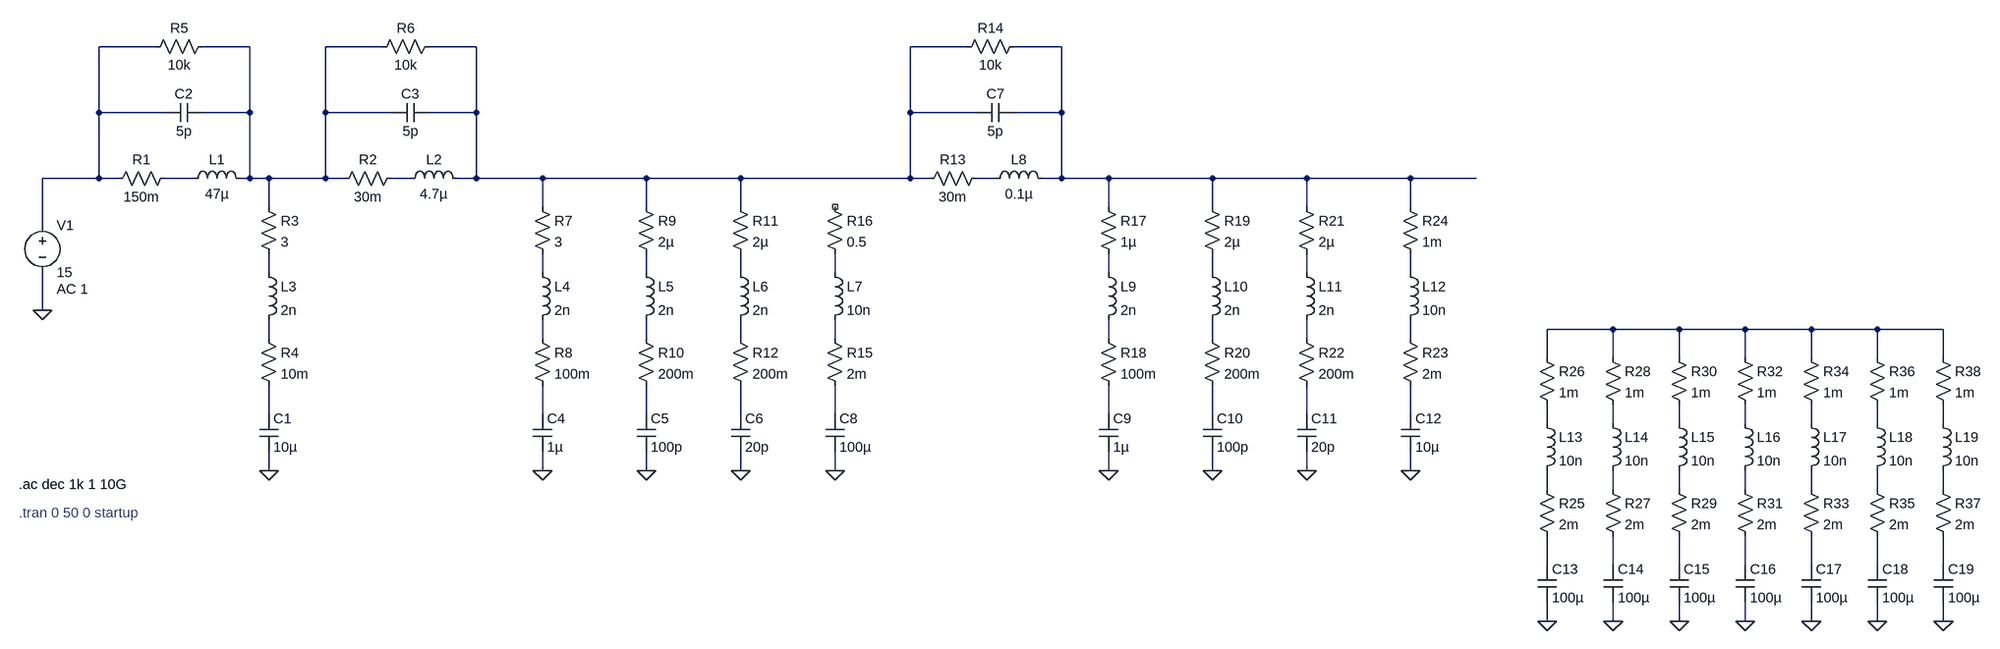
[diagram p0: schematic EMI_Filter.asc]
EMI_Filter.asc, the LTspice schematic file:
Version 4
SHEET 1 4652 1140
WIRE 320 -176 224 -176
WIRE 480 -176 400 -176
WIRE 704 -176 608 -176
WIRE 864 -176 784 -176
WIRE 1696 -176 1600 -176
WIRE 1856 -176 1776 -176
WIRE 224 -64 224 -176
WIRE 336 -64 224 -64
WIRE 480 -64 480 -176
WIRE 480 -64 400 -64
WIRE 608 -64 608 -176
WIRE 720 -64 608 -64
WIRE 864 -64 864 -176
WIRE 864 -64 784 -64
WIRE 1600 -64 1600 -176
WIRE 1712 -64 1600 -64
WIRE 1856 -64 1856 -176
WIRE 1856 -64 1776 -64
WIRE 224 48 224 -64
WIRE 224 48 128 48
WIRE 256 48 224 48
WIRE 384 48 336 48
WIRE 480 48 480 -64
WIRE 480 48 464 48
WIRE 512 48 480 48
WIRE 608 48 608 -64
WIRE 608 48 512 48
WIRE 640 48 608 48
WIRE 752 48 720 48
WIRE 864 48 864 -64
WIRE 864 48 832 48
WIRE 976 48 864 48
WIRE 1152 48 976 48
WIRE 1312 48 1152 48
WIRE 1600 48 1600 -64
WIRE 1600 48 1312 48
WIRE 1632 48 1600 48
WIRE 1744 48 1712 48
WIRE 1856 48 1856 -64
WIRE 1856 48 1824 48
WIRE 1936 48 1856 48
WIRE 2112 48 1936 48
WIRE 2272 48 2112 48
WIRE 2448 48 2272 48
WIRE 2560 48 2448 48
WIRE 512 96 512 48
WIRE 976 96 976 48
WIRE 1152 96 1152 48
WIRE 1312 96 1312 48
WIRE 1936 96 1936 48
WIRE 2112 96 2112 48
WIRE 2272 96 2272 48
WIRE 2448 96 2448 48
WIRE 128 128 128 48
WIRE 512 208 512 176
WIRE 976 208 976 176
WIRE 1152 208 1152 176
WIRE 1312 208 1312 176
WIRE 1472 208 1472 176
WIRE 1936 208 1936 176
WIRE 2112 208 2112 176
WIRE 2272 208 2272 176
WIRE 2448 208 2448 176
WIRE 128 272 128 208
WIRE 3120 304 3008 304
WIRE 3232 304 3120 304
WIRE 3344 304 3232 304
WIRE 3456 304 3344 304
WIRE 3568 304 3456 304
WIRE 3680 304 3568 304
WIRE 512 320 512 288
WIRE 976 320 976 288
WIRE 1152 320 1152 288
WIRE 1312 320 1312 288
WIRE 1472 320 1472 288
WIRE 1936 320 1936 288
WIRE 2112 320 2112 288
WIRE 2272 320 2272 288
WIRE 2448 320 2448 288
WIRE 3008 352 3008 304
WIRE 3120 352 3120 304
WIRE 3232 352 3232 304
WIRE 3344 352 3344 304
WIRE 3456 352 3456 304
WIRE 3568 352 3568 304
WIRE 3680 352 3680 304
WIRE 512 448 512 400
WIRE 976 448 976 400
WIRE 1152 448 1152 400
WIRE 1312 448 1312 400
WIRE 1472 448 1472 400
WIRE 1936 448 1936 400
WIRE 2112 448 2112 400
WIRE 2272 448 2272 400
WIRE 2448 448 2448 400
WIRE 3008 464 3008 432
WIRE 3120 464 3120 432
WIRE 3232 464 3232 432
WIRE 3344 464 3344 432
WIRE 3456 464 3456 432
WIRE 3568 464 3568 432
WIRE 3680 464 3680 432
WIRE 512 544 512 512
WIRE 976 544 976 512
WIRE 1152 544 1152 512
WIRE 1312 544 1312 512
WIRE 1472 544 1472 512
WIRE 1936 544 1936 512
WIRE 2112 544 2112 512
WIRE 2272 544 2272 512
WIRE 2448 544 2448 512
WIRE 3008 576 3008 544
WIRE 3120 576 3120 544
WIRE 3232 576 3232 544
WIRE 3344 576 3344 544
WIRE 3456 576 3456 544
WIRE 3568 576 3568 544
WIRE 3680 576 3680 544
WIRE 3008 704 3008 656
WIRE 3120 704 3120 656
WIRE 3232 704 3232 656
WIRE 3344 704 3344 656
WIRE 3456 704 3456 656
WIRE 3568 704 3568 656
WIRE 3680 704 3680 656
WIRE 3008 800 3008 768
WIRE 3120 800 3120 768
WIRE 3232 800 3232 768
WIRE 3344 800 3344 768
WIRE 3456 800 3456 768
WIRE 3568 800 3568 768
WIRE 3680 800 3680 768
FLAG 128 272 0
FLAG 512 544 0
FLAG 976 544 0
FLAG 1152 544 0
FLAG 1312 544 0
FLAG 1936 544 0
FLAG 2112 544 0
FLAG 2272 544 0
FLAG 2448 544 0
FLAG 1472 544 0
FLAG 3008 800 0
FLAG 3120 800 0
FLAG 3232 800 0
FLAG 3344 800 0
FLAG 3456 800 0
FLAG 3568 800 0
FLAG 3680 800 0
SYMBOL voltage 128 112 R0
WINDOW 123 24 124 Left 2
WINDOW 39 0 0 Left 0
SYMATTR Value2 AC 1
SYMATTR InstName V1
SYMATTR Value 15
SYMBOL res 352 32 R90
WINDOW 0 0 56 VBottom 2
WINDOW 3 32 56 VTop 2
SYMATTR InstName R1
SYMATTR Value 150m
SYMBOL res 736 32 R90
WINDOW 0 0 56 VBottom 2
WINDOW 3 32 56 VTop 2
SYMATTR InstName R2
SYMATTR Value 30m
SYMBOL ind 368 64 R270
WINDOW 0 32 56 VTop 2
WINDOW 3 5 56 VBottom 2
SYMATTR InstName L1
SYMATTR Value 47µ
SYMBOL ind 736 64 R270
WINDOW 0 32 56 VTop 2
WINDOW 3 5 56 VBottom 2
SYMATTR InstName L2
SYMATTR Value 4.7µ
SYMBOL res 496 80 R0
SYMATTR InstName R3
SYMATTR Value 3
SYMBOL cap 496 448 R0
SYMATTR InstName C1
SYMATTR Value 10µ
SYMBOL ind 496 192 R0
SYMATTR InstName L3
SYMATTR Value 2n
SYMBOL res 496 304 R0
SYMATTR InstName R4
SYMATTR Value 10m
SYMBOL cap 400 -80 R90
WINDOW 0 0 32 VBottom 2
WINDOW 3 32 32 VTop 2
SYMATTR InstName C2
SYMATTR Value 5p
SYMBOL res 416 -192 R90
WINDOW 0 0 56 VBottom 2
WINDOW 3 32 56 VTop 2
SYMATTR InstName R5
SYMATTR Value 10k
SYMBOL cap 784 -80 R90
WINDOW 0 0 32 VBottom 2
WINDOW 3 32 32 VTop 2
SYMATTR InstName C3
SYMATTR Value 5p
SYMBOL res 800 -192 R90
WINDOW 0 0 56 VBottom 2
WINDOW 3 32 56 VTop 2
SYMATTR InstName R6
SYMATTR Value 10k
SYMBOL res 960 80 R0
SYMATTR InstName R7
SYMATTR Value 3
SYMBOL cap 960 448 R0
SYMATTR InstName C4
SYMATTR Value 1µ
SYMBOL ind 960 192 R0
SYMATTR InstName L4
SYMATTR Value 2n
SYMBOL res 960 304 R0
SYMATTR InstName R8
SYMATTR Value 100m
SYMBOL res 1136 80 R0
SYMATTR InstName R9
SYMATTR Value 2µ
SYMBOL cap 1136 448 R0
SYMATTR InstName C5
SYMATTR Value 100p
SYMBOL ind 1136 192 R0
SYMATTR InstName L5
SYMATTR Value 2n
SYMBOL res 1136 304 R0
SYMATTR InstName R10
SYMATTR Value 200m
SYMBOL res 1296 80 R0
SYMATTR InstName R11
SYMATTR Value 2µ
SYMBOL cap 1296 448 R0
SYMATTR InstName C6
SYMATTR Value 20p
SYMBOL ind 1296 192 R0
SYMATTR InstName L6
SYMATTR Value 2n
SYMBOL res 1296 304 R0
SYMATTR InstName R12
SYMATTR Value 200m
SYMBOL res 1728 32 R90
WINDOW 0 0 56 VBottom 2
WINDOW 3 32 56 VTop 2
SYMATTR InstName R13
SYMATTR Value 30m
SYMBOL ind 1728 64 R270
WINDOW 0 32 56 VTop 2
WINDOW 3 5 56 VBottom 2
SYMATTR InstName L8
SYMATTR Value 0.1µ
SYMBOL cap 1776 -80 R90
WINDOW 0 0 32 VBottom 2
WINDOW 3 32 32 VTop 2
SYMATTR InstName C7
SYMATTR Value 5p
SYMBOL res 1792 -192 R90
WINDOW 0 0 56 VBottom 2
WINDOW 3 32 56 VTop 2
SYMATTR InstName R14
SYMATTR Value 10k
SYMBOL res 1920 80 R0
SYMATTR InstName R17
SYMATTR Value 1µ
SYMBOL cap 1920 448 R0
SYMATTR InstName C9
SYMATTR Value 1µ
SYMBOL ind 1920 192 R0
SYMATTR InstName L9
SYMATTR Value 2n
SYMBOL res 1920 304 R0
SYMATTR InstName R18
SYMATTR Value 100m
SYMBOL res 2096 80 R0
SYMATTR InstName R19
SYMATTR Value 2µ
SYMBOL cap 2096 448 R0
SYMATTR InstName C10
SYMATTR Value 100p
SYMBOL ind 2096 192 R0
SYMATTR InstName L10
SYMATTR Value 2n
SYMBOL res 2096 304 R0
SYMATTR InstName R20
SYMATTR Value 200m
SYMBOL res 2256 80 R0
SYMATTR InstName R21
SYMATTR Value 2µ
SYMBOL cap 2256 448 R0
SYMATTR InstName C11
SYMATTR Value 20p
SYMBOL ind 2256 192 R0
SYMATTR InstName L11
SYMATTR Value 2n
SYMBOL res 2256 304 R0
SYMATTR InstName R22
SYMATTR Value 200m
SYMBOL cap 2432 448 R0
SYMATTR InstName C12
SYMATTR Value 10µ
SYMBOL ind 2432 192 R0
SYMATTR InstName L12
SYMATTR Value 10n
SYMBOL res 2432 304 R0
SYMATTR InstName R23
SYMATTR Value 2m
SYMBOL res 2432 80 R0
SYMATTR InstName R24
SYMATTR Value 1m
SYMBOL cap 1456 448 R0
SYMATTR InstName C8
SYMATTR Value 100µ
SYMBOL ind 1456 192 R0
SYMATTR InstName L7
SYMATTR Value 10n
SYMBOL res 1456 304 R0
SYMATTR InstName R15
SYMATTR Value 2m
SYMBOL res 1456 80 R0
SYMATTR InstName R16
SYMATTR Value 0.5
SYMBOL cap 2992 704 R0
SYMATTR InstName C13
SYMATTR Value 100µ
SYMBOL ind 2992 448 R0
SYMATTR InstName L13
SYMATTR Value 10n
SYMBOL res 2992 560 R0
SYMATTR InstName R25
SYMATTR Value 2m
SYMBOL res 2992 336 R0
SYMATTR InstName R26
SYMATTR Value 1m
SYMBOL cap 3104 704 R0
SYMATTR InstName C14
SYMATTR Value 100µ
SYMBOL ind 3104 448 R0
SYMATTR InstName L14
SYMATTR Value 10n
SYMBOL res 3104 560 R0
SYMATTR InstName R27
SYMATTR Value 2m
SYMBOL res 3104 336 R0
SYMATTR InstName R28
SYMATTR Value 1m
SYMBOL cap 3216 704 R0
SYMATTR InstName C15
SYMATTR Value 100µ
SYMBOL ind 3216 448 R0
SYMATTR InstName L15
SYMATTR Value 10n
SYMBOL res 3216 560 R0
SYMATTR InstName R29
SYMATTR Value 2m
SYMBOL res 3216 336 R0
SYMATTR InstName R30
SYMATTR Value 1m
SYMBOL cap 3328 704 R0
SYMATTR InstName C16
SYMATTR Value 100µ
SYMBOL ind 3328 448 R0
SYMATTR InstName L16
SYMATTR Value 10n
SYMBOL res 3328 560 R0
SYMATTR InstName R31
SYMATTR Value 2m
SYMBOL res 3328 336 R0
SYMATTR InstName R32
SYMATTR Value 1m
SYMBOL cap 3440 704 R0
SYMATTR InstName C17
SYMATTR Value 100µ
SYMBOL ind 3440 448 R0
SYMATTR InstName L17
SYMATTR Value 10n
SYMBOL res 3440 560 R0
SYMATTR InstName R33
SYMATTR Value 2m
SYMBOL res 3440 336 R0
SYMATTR InstName R34
SYMATTR Value 1m
SYMBOL cap 3552 704 R0
SYMATTR InstName C18
SYMATTR Value 100µ
SYMBOL ind 3552 448 R0
SYMATTR InstName L18
SYMATTR Value 10n
SYMBOL res 3552 560 R0
SYMATTR InstName R35
SYMATTR Value 2m
SYMBOL res 3552 336 R0
SYMATTR InstName R36
SYMATTR Value 1m
SYMBOL cap 3664 704 R0
SYMATTR InstName C19
SYMATTR Value 100µ
SYMBOL ind 3664 448 R0
SYMATTR InstName L19
SYMATTR Value 10n
SYMBOL res 3664 560 R0
SYMATTR InstName R37
SYMATTR Value 2m
SYMBOL res 3664 336 R0
SYMATTR InstName R38
SYMATTR Value 1m
TEXT 88 568 Left 2 !.ac dec 1k 1 10G
TEXT 88 616 Left 2 ;.tran 0 50 0 startup

The netlist it stands for:
* EMI_Filter.asc
V1 N001 0 15 AC 1
R1 N005 N001 150m
R2 N006 N002 30m
L1 N005 N002 47µ
L2 N006 N003 4.7µ
R3 N002 N008 3
C1 N027 0 10µ
L3 N008 N018 2n
R4 N018 N027 10m
C2 N002 N001 5p
R5 N002 N001 10k
C3 N003 N002 5p
R6 N003 N002 10k
R7 N003 N009 3
C4 N028 0 1µ
L4 N009 N019 2n
R8 N019 N028 100m
R9 N003 N010 2µ
C5 N029 0 100p
L5 N010 N020 2n
R10 N020 N029 200m
R11 N003 N011 2µ
C6 N030 0 20p
L6 N011 N021 2n
R12 N021 N030 200m
R13 N007 N003 30m
L8 N007 N004 0.1µ
C7 N004 N003 5p
R14 N004 N003 10k
R17 N004 N013 1µ
C9 N032 0 1µ
L9 N013 N023 2n
R18 N023 N032 100m
R19 N004 N014 2µ
C10 N033 0 100p
L10 N014 N024 2n
R20 N024 N033 200m
R21 N004 N015 2µ
C11 N034 0 20p
L11 N015 N025 2n
R22 N025 N034 200m
C12 N035 0 10µ
L12 N016 N026 10n
R23 N026 N035 2m
R24 N004 N016 1m
C8 N031 0 100µ
L7 N012 N022 10n
R15 N022 N031 2m
R16 NC_01 N012 0.5
C13 N050 0 100µ
L13 N036 N043 10n
R25 N043 N050 2m
R26 N017 N036 1m
C14 N051 0 100µ
L14 N037 N044 10n
R27 N044 N051 2m
R28 N017 N037 1m
C15 N052 0 100µ
L15 N038 N045 10n
R29 N045 N052 2m
R30 N017 N038 1m
C16 N053 0 100µ
L16 N039 N046 10n
R31 N046 N053 2m
R32 N017 N039 1m
C17 N054 0 100µ
L17 N040 N047 10n
R33 N047 N054 2m
R34 N017 N040 1m
C18 N055 0 100µ
L18 N041 N048 10n
R35 N048 N055 2m
R36 N017 N041 1m
C19 N056 0 100µ
L19 N042 N049 10n
R37 N049 N056 2m
R38 N017 N042 1m
.ac dec 1k 1 10G
* .tran 0 50 0 startup
.backanno
.end